# Altium project Push_counter.PrjPcb
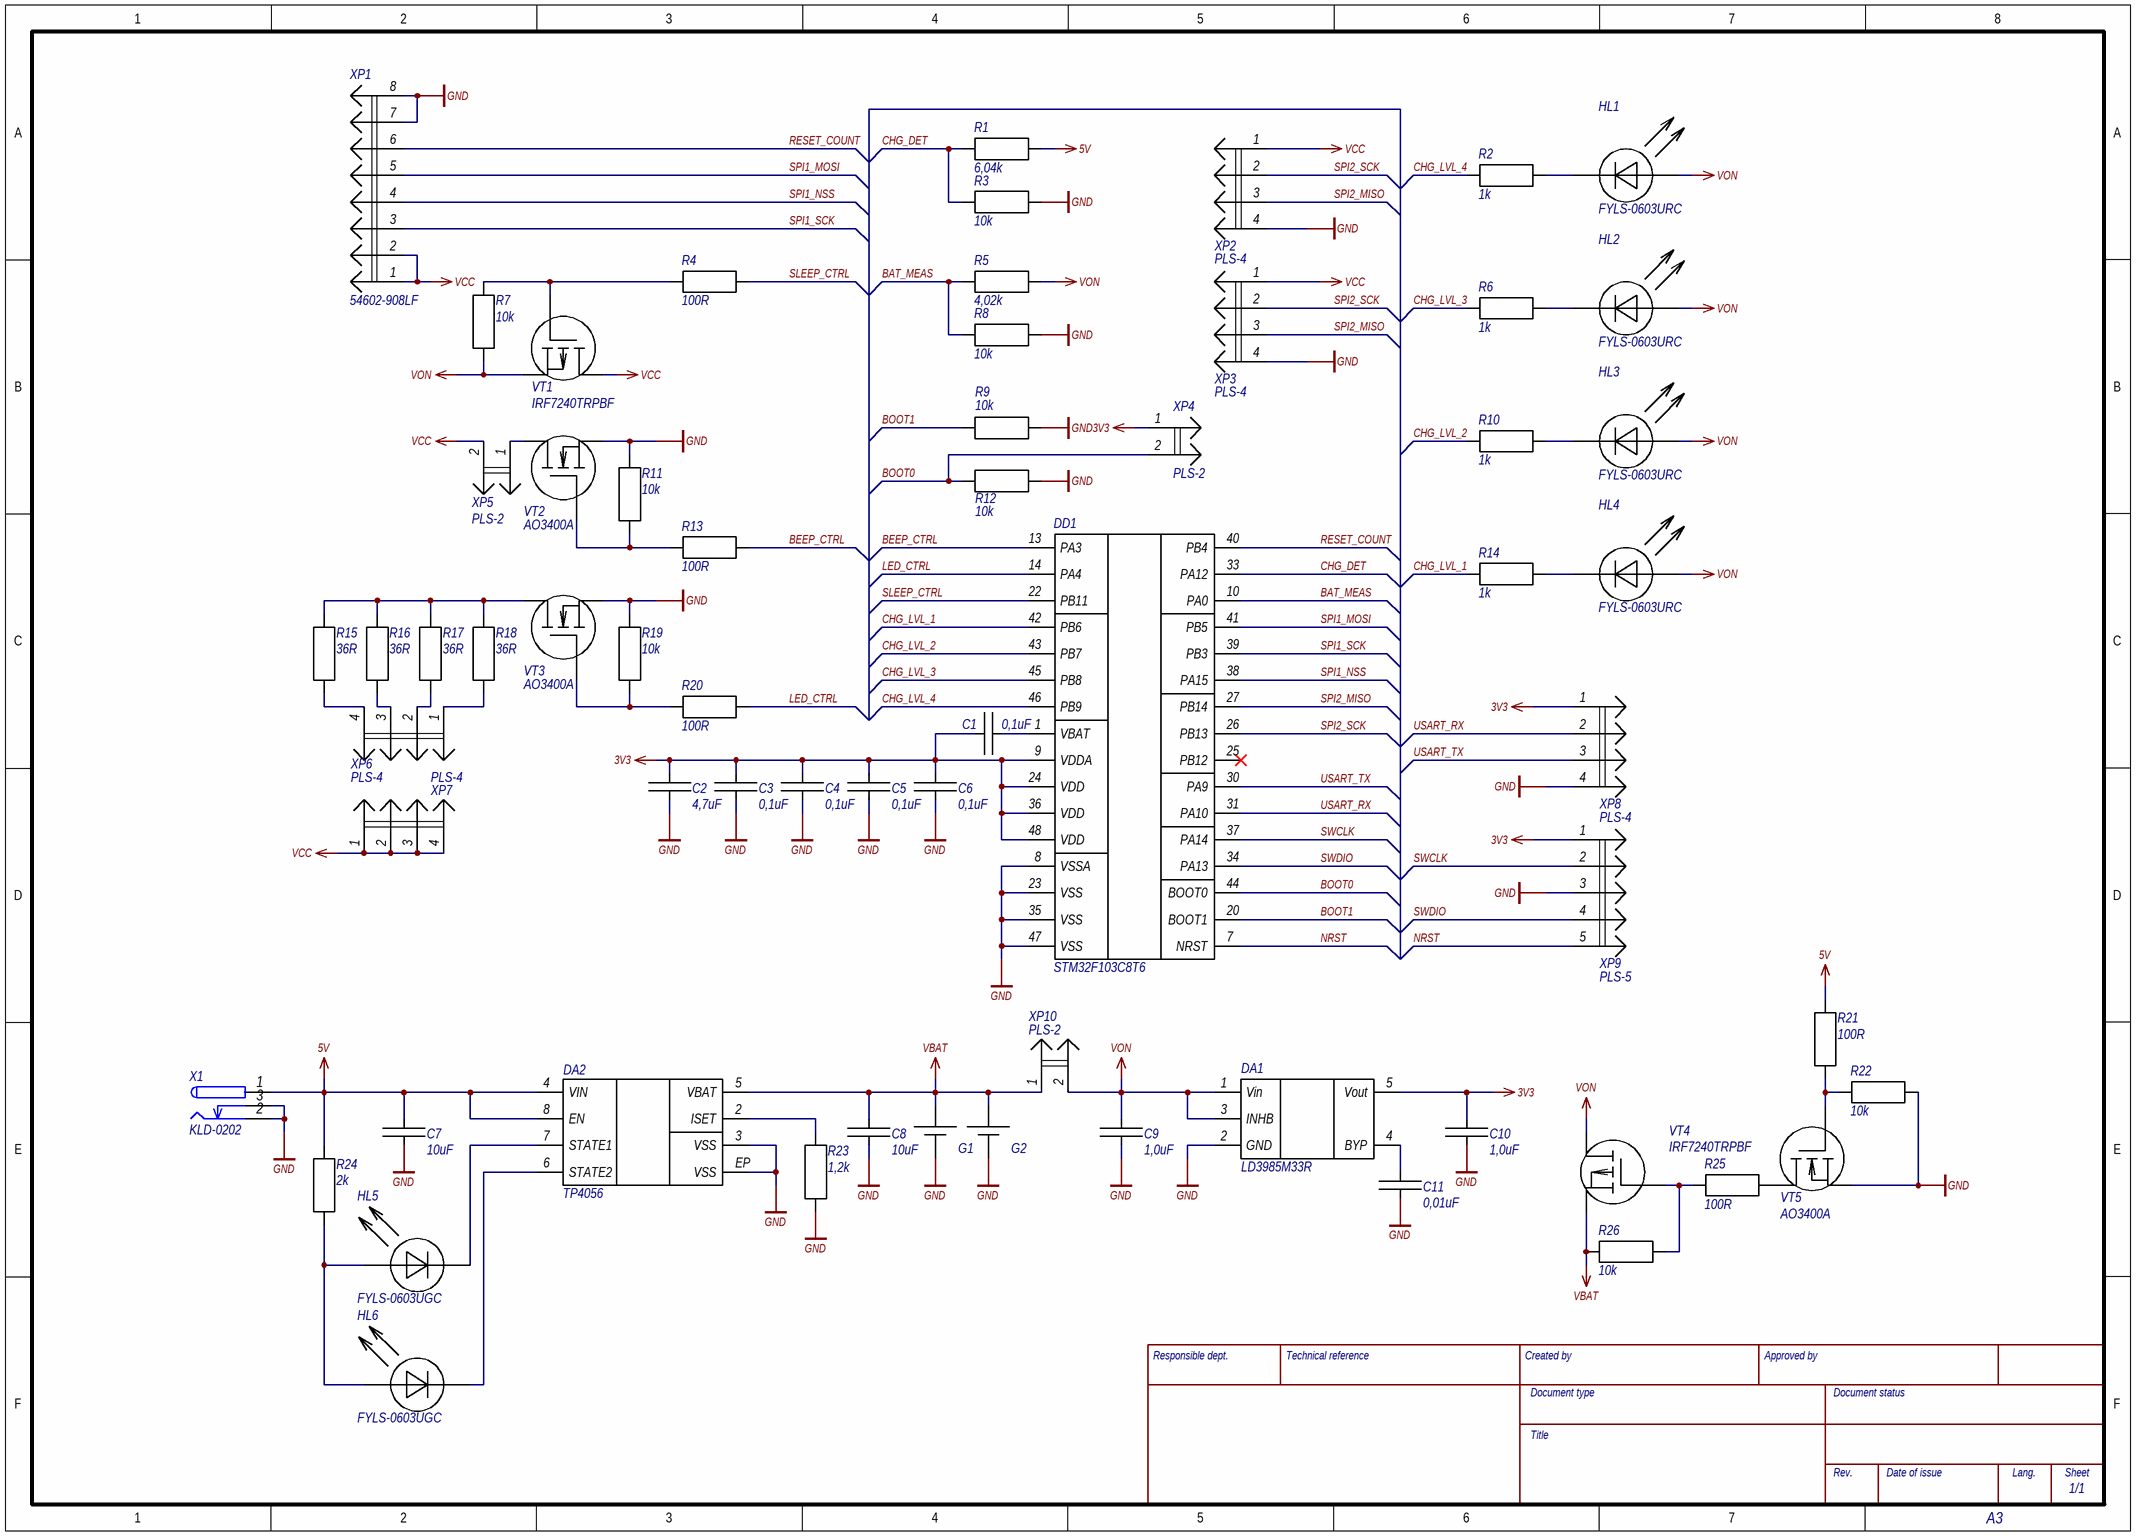
[diagram p0: Push_counter.SchDoc]
1 sheet, 64 parts. Net scope: global (net labels, ports and power ports of the same name join across sheets).
Board file: Push_counter.PcbDoc

## Sheet Push_counter.SchDoc
size 400 x 287 mm; SheetNumber: 1; SheetTotal: 1

### Parts
C1  0,1uF  [C0603C]
C2  4,7uF  [C0805C]
C3  0,1uF  [C0603C]
C4  0,1uF  [C0603C]
C5  0,1uF  [C0603C]
C6  0,1uF  [C0603C]
C7  10uF  [C1210C]
C8  10uF  [C1210C]
C9  1,0uF  [C0603C]
C10  1,0uF  [C0603C]
C11  0,01uF  [C0603C]
DA1  LD3985M33R  [SOT23-5]
DA2  TP4056  [SO-8-EP]
DD1  STM32F103C8T6  [LQFP48]
G1  KLS5-18650-L  [KLS5-18650-L]  (value not drawn)
G2  KLS5-18650-L  [KLS5-18650-L]  (value not drawn)
HL1  FYLS-0603URC  [LED0603]
HL2  FYLS-0603URC  [LED0603]
HL3  FYLS-0603URC  [LED0603]
HL4  FYLS-0603URC  [LED0603]
HL5  FYLS-0603UGC  [LED0603]
HL6  FYLS-0603UGC  [LED0603]
R1  6,04k  [C0603R]
R2  1k  [C0603R]
R3  10k  [C0603R]
R4  100R  [C0603R]
R5  4,02k  [C0603R]
R6  1k  [C0603R]
R7  10k  [C0603R]
R8  10k  [C0603R]
R9  10k  [C0603R]
R10  1k  [C0603R]
R11  10k  [C0603R]
R12  10k  [C0603R]
R13  100R  [C0603R]
R14  1k  [C0603R]
R15  36R  [C1206R]
R16  36R  [C1206R]
R17  36R  [C1206R]
R18  36R  [C1206R]
R19  10k  [C0603R]
R20  100R  [C0603R]
R21  100R  [C0603R]
R22  10k  [C0603R]
R23  1,2k  [C0603R]
R24  2k  [C0603R]
R25  100R  [C0603R]
R26  10k  [C0603R]
VT1  IRF7240TRPBF  [SO-8-SINGLE-FET]
VT2  AO3400A  [SOT23-3-FET]
VT3  AO3400A  [SOT23-3-FET]
VT4  IRF7240TRPBF  [SO-8-SINGLE-FET]
VT5  AO3400A  [SOT23-3-FET]
X1  KLD-0202  [KLD-0202]
XP1  54602-908LF  [54602-908LF]
XP2  PLS-4  [PLS-4]
XP3  PLS-4  [PLS-4]
XP4  PLS-2  [PLS-2]
XP5  PLS-2  [PLS-2]
XP6  PLS-4  [PLS-4]
XP7  PLS-4  [PLS-4]
XP8  PLS-4  [PLS-4]
XP9  PLS-5  [PLS-5]
XP10  PLS-2  [PLS-2]

### Nets
3V3: C1.1 C2.1 C3.1 C4.1 C5.1 C6.1 C10.1 DA1.5(Vout) DD1.9(VDDA) DD1.24(VDD) DD1.36(VDD) DD1.48(VDD) XP4.1 XP8.1 XP9.1
5V: C7.1 DA2.4(VIN) DA2.8(EN) R1.1 R21.1 R24.1 X1.1
GND: C2.2 C3.2 C4.2 C5.2 C6.2 C7.2 C8.2 C9.2 C10.2 C11.2 DA1.2(GND) DA2.3(VSS) DA2.EP(VSS) DD1.8(VSSA) DD1.23(VSS) DD1.35(VSS) DD1.47(VSS) G1.1(-) G2.1(-) R3.1 R8.1 R9.1 R11.1 R12.1 R19.1 R22.2 R23.2 VT2.S VT3.S VT5.S X1.2 X1.3 XP1.7 XP1.8 XP2.4 XP3.4 XP8.4 XP9.3
VBAT: C8.1 DA2.5(VBAT) G1.2(+) G2.2(+) R26.1 VT4.S XP10.1
VCC: VT1.D XP1.1 XP1.2 XP2.1 XP3.1 XP5.2 XP7.1 XP7.2 XP7.3 XP7.4
VON: C9.1 DA1.1(Vin) DA1.3(INHB) HL1.1(A) HL2.1(A) HL3.1(A) HL4.1(A) R5.1 R7.1 VT1.S VT4.D XP10.2
BAT_MEAS: DD1.10(PA0) R5.2 R8.2
BEEP_CTRL: DD1.13(PA3) R13.1
BOOT0: DD1.44(BOOT0) R12.2 XP4.2
BOOT1: DD1.20(BOOT1) R9.2
CHG_DET: DD1.33(PA12) R1.2 R3.2
CHG_LVL_1: DD1.42(PB6) R14.2
CHG_LVL_2: DD1.43(PB7) R10.2
CHG_LVL_3: DD1.45(PB8) R6.2
CHG_LVL_4: DD1.46(PB9) R2.2
LED_CTRL: DD1.14(PA4) R20.1
NRST: DD1.7(NRST) XP9.5
RESET_COUNT: DD1.40(PB4) XP1.6
SLEEP_CTRL: DD1.22(PB11) R4.1
SPI1_MOSI: DD1.41(PB5) XP1.5
SPI1_NSS: DD1.38(PA15) XP1.4
SPI1_SCK: DD1.39(PB3) XP1.3
SPI2_MISO: DD1.27(PB14) XP2.3 XP3.3
SPI2_SCK: DD1.26(PB13) XP2.2 XP3.2
SWCLK: DD1.37(PA14) XP9.2
SWDIO: DD1.34(PA13) XP9.4
USART_RX: DD1.31(PA10) XP8.2
USART_TX: DD1.30(PA9) XP8.3
NetC1_2: C1.2 DD1.1(VBAT)
NetC11_1: C11.1 DA1.4(BYP)
NetDA2_2: DA2.2(ISET) R23.1
NetDA2_6: DA2.6(STATE2) HL6.2(C)
NetDA2_7: DA2.7(STATE1) HL5.2(C)
NetHL1_2: HL1.2(C) R2.1
NetHL2_2: HL2.2(C) R6.1
NetHL3_2: HL3.2(C) R10.1
NetHL4_2: HL4.2(C) R14.1
NetHL5_1: HL5.1(A) HL6.1(A) R24.2
NetR4_2: R4.2 R7.2 VT1.G
NetR11_2: R11.2 R13.2 VT2.G
NetR15_1: R15.1 R16.1 R17.1 R18.1 VT3.D
NetR15_2: R15.2 XP6.4
NetR16_2: R16.2 XP6.3
NetR17_2: R17.2 XP6.2
NetR18_2: R18.2 XP6.1
NetR19_2: R19.2 R20.2 VT3.G
NetR21_2: R21.2 R22.1 VT5.G
NetR25_1: R25.1 R26.2 VT4.G
NetR25_2: R25.2 VT5.D
NetVT2_D: VT2.D XP5.1

Not connected (* = marked no-connect by the designer): DD1 25(PB12)*

### Notes on the sheet
- Responsible dept.
- Technical reference
- Created by
- Approved by
- Document type
- Document status
- Title
- Rev.
- Date of issue
- Lang.
- Sheet
- A3

### Library data of the parts
C1 C3-C6 = C0603C104K5RACAUTO: C0603C104K5RACAUTO, 0603 X7R  0,1 uF 50V; Manufacturer: KEMET; Value: 0,1; Tolerance: ±10%; Tmin: -55; Tmax: 125; Component Note: 0603 0,1uF ±10% 50V X7R; Part Number: C0603C104K5RACAUTO; Package: SMD 0603; Units: uF; Dielectric: X7R; Voltage: 50V; ComponentLink1Description: Datasheet
C2 = CL21B475KOFNFNE: CL21B475KOFNFNE, 0805 X7R 4,7 uF 16V; Manufacturer: Samsung; Value: 4,7; Tolerance: ±10%; Tmin: -55; Tmax: 125; Component Note: 0805 4,7uF ±10% 16V X7R; Part Number: CL21B475KOFNFNE; Package: SMD 0805; Units: uF; Dielectric: X7R; Voltage: 16V; ComponentLink1Description: Datasheet; ComponentLink1URL: https://media.digikey.com/pdf/Data%20Sheets/Samsung%20PDFs/CL_Series_MLCC_ds.pdf
C7 C8 = C3225X7R1H106M250AC: C3225X7R1H106M250AC, 1210 X7R 10 uF 50V; Manufacturer: TDK; Value: 10; Tolerance: ±20%; Tmin: -55; Tmax: 125; Component Note: 1210 10uF ±20% 50V X7R; Part Number: C3225X7R1H106M250AC; Package: SMD 1210; Units: uF; Dielectric: X7R; Voltage: 50V; ComponentLink1Description: Datasheet; ComponentLink1URL: https://ru.mouser.com/datasheet/2/400/lcc_commercial_general_en-837201.pdf
C9 C10 = CL10B105KA8NNNC: CL10B105KA8NNNC, 0603 X7R 1,0 uF 25V; Manufacturer: Samsung; Value: 1,0; Tolerance: ±10%; Tmin: -55; Tmax: 125; Component Note: 0603 1,0uF ±10% 25V X7R; Part Number: CL10B105KA8NNNC; Package: SMD 0603; Units: uF; Dielectric: X7R; Voltage: 25V; ComponentLink1Description: Datasheet; ComponentLink1URL: https://media.digikey.com/pdf/Data%20Sheets/Samsung%20PDFs/CL_Series_MLCC_ds.pdf
C11 = CL10B103KC8NNNC: CL10B103KC8NNNC, 0603 X7R 0,01 uF 100V; Manufacturer: Samsung; Value: 0,01; Tolerance: ±10%; Tmin: -55; Tmax: 125; Component Note: 0603 0,01uF ±10% 100V X7R; Part Number: CL10B103KC8NNNC; Package: SMD 0603; Units: uF; Dielectric: X7R; Voltage: 100V; ComponentLink1Description: Datasheet
DA1 = LD3985M33R: Linear Voltage Regulator; Manufacturer: Microchip Technology; TypeConvert: DC/DC; Vin: 5,5; VinMax: 6; Vout: 3,3; Iout: 0,5; Tmin: -40; Tmax: 125; BOM: DC/DC 5,5-6V, 3,3V,; Part Number: LD3985M33R; Package: SOT23-5; ComponentLink1Description: Datasheet; ComponentLink1URL: https://www.electronshik.ru/pdf/l/ld3985.pdf
DA2 = TP4056: Manufacturer: UMW; TypeConvert: SLLBC; Vin: 5; VinMax: 8; Iout: 1; Tmin: -40; Tmax: 125; BOM: SLLBC 5-8V, V,; Part Number: TP4056; Package: SO-8-EP; ComponentLink1Description: Datasheet; ComponentLink1URL: https://static.chipdip.ru/lib/848/DOC018848830.pdf
DD1 = STM32F103C8T6: STM32F103C8T6, 64 KB Flash, 20 KB RAM, LQFP48; Manufacturer: STMicroelectronics; Core: ARM Cortex-M3; CPU Speed: 1.25 DMIPS/MHz; FREQ: 72; RAM: 20 KB; FLASH: 64 KB; CAN: 1; Tmin: -40; Tmax: 125; Part Number: STM32F103C8T6; Package: LQFP48; EEPROM: -; ETH: -; ComponentLink1Description: Datasheet; Component Note: LQFP48
G1 G2 = KLS5-18650-L: KLS5-18650-L, , BAT; System: Connector; Part Number: KLS5-18650-L; Type: BAT; ComponentLink1Description: Datasheet
HL1-HL4 = FYLS-0603URC: SMD 0603 Red 30mA 80mcd; Manufacturer: Foryard; Alternative: LTST-C191KRKT Lite-On Inc; Voltage: 2.1V; Component Note: 0603, Red; Part Number: FYLS-0603URC; Package: SMD 0603; Color: Red; Current: 30mA; Luminous intensity: 80mcd; ComponentLink1Description: Datasheet; ComponentLink1URL: https://sds.compel.ru/item-pdf/af7b1cc2bbe1d373f48bd8c95fbe7607/pn/foryard~fyls-0603urc.pdf
HL5 HL6 = FYLS-0603UGC: SMD 0603 Green 30mA 65mcd; Manufacturer: Foryard; Alternative: LTST-C191KGKT Lite-On Inc; Voltage: 2V; Component Note: 0603, Green; Part Number: FYLS-0603UGC; Package: SMD 0603; Color: Green; Current: 30mA; Luminous intensity: 65mcd; ComponentLink1Description: Datasheet; ComponentLink1URL: https://sds.compel.ru/item-pdf/bfcdb1ef531cd95dc93bcbdb85ab35c3/pn/foryard~fyls-0603ugc.pdf
R1 = RC0603FR-076K04L: RC0603FR-076K04L, 1% 6,04k; Manufacturer: Yageo; ppm: 100; Power: 0,1; Voltage: 75; Component Note: 0603 6,04k 1%; Part Number: RC0603FR-076K04L; Package: SMD 0603; Value: 6,04k; Tolerance: 1%
R2 R6 R10 R14 = RC0603JR-071KL: RC0603JR-071KL, 5% 1k; Manufacturer: Yageo; ppm: 100; Power: 0,1; Voltage: 75; Component Note: 0603 1k 5%; Part Number: RC0603JR-071KL; Package: SMD 0603; Value: 1k; Tolerance: 5%
R3 R8 = RC0603FR-0710KL: RC0603FR-0710KL, 1% 10k; Manufacturer: Yageo; ppm: 100; Power: 0,1; Voltage: 75; Component Note: 0603 10k 1%; Part Number: RC0603FR-0710KL; Package: SMD 0603; Value: 10k; Tolerance: 1%
R4 R13 R20 R21 R25 = RC0603FR-07100RL: RC0603FR-07100RL, 1% 100R; Manufacturer: Yageo; ppm: 100; Power: 0,1; Voltage: 75; Component Note: 0603 100R 1%; Part Number: RC0603FR-07100RL; Package: SMD 0603; Value: 100R; Tolerance: 1%
R5 = RC0603FR-074K02L: RC0603FR-074K02L, 1% 4,02k; Manufacturer: Yageo; ppm: 100; Power: 0,1; Voltage: 75; Component Note: 0603 4,02k 1%; Part Number: RC0603FR-074K02L; Package: SMD 0603; Value: 4,02k; Tolerance: 1%
R7 R9 R11 R12 R19 R22 R26 = RC0603JR-0710KL: RC0603JR-0710KL, 5% 10k; Manufacturer: Yageo; ppm: 100; Power: 0,1; Voltage: 75; Component Note: 0603 10k 5%; Part Number: RC0603JR-0710KL; Package: SMD 0603; Value: 10k; Tolerance: 5%
R15-R18 = RC1206JR-0736RL: RC1206JR-0736RL, 5% 36R; Manufacturer: Yageo; ppm: 100; Power: 0,125; Voltage: 150; Component Note: 1206 36R 5%; Part Number: RC1206JR-0736RL; Package: SMD 1206; Value: 36R; Tolerance: 5%
R23 = RC0603JR-071K2L: RC0603JR-071K2L, 5% 1,2k; Manufacturer: Yageo; ppm: 100; Power: 0,1; Voltage: 75; Component Note: 0603 1,2k 5%; Part Number: RC0603JR-071K2L; Package: SMD 0603; Value: 1,2k; Tolerance: 5%
R24 = RC0603JR-072KL: RC0603JR-072KL, 5% 2k; Manufacturer: Yageo; ppm: 100; Power: 0,1; Voltage: 75; Component Note: 0603 2k 5%; Part Number: RC0603JR-072KL; Package: SMD 0603; Value: 2k; Tolerance: 5%
VT1 VT4 = IRF7240TRPBF: IRF7240TRPBF, SO-8 A V; Manufacturer: Infineon; Type: P; Component Note: SO-8, P, V, A; Part Number: IRF7240TRPBF; Package: SO-8; ComponentLink1Description: Datasheet; ComponentLink1URL: https://static.chipdip.ru/lib/404/DOC016404580.pdf
VT2 VT3 VT5 = AO3400A: AO3400A, SOT23-3 5A 30V; Manufacturer: UMW; Type: N; I Drain: 5; U Gate th: 1,4; U Gate max: 12; U Drain-Source: 30; Input Cap: 1050; RDS: 0,033; P: 1W; Component Note: SOT23-3, N, 30V, 5A; Part Number: AO3400A; Package: SOT23-3; Qg: 12; ComponentLink1Description: Datasheet; ComponentLink1URL: https://static.chipdip.ru/lib/975/DOC014975392.pdf
X1 = KLD-0202: KLD-0202, Kycon,; System: Connector; Part Number: KLD-0202; Manufacturer: Kycon; ComponentLink1Description: Datasheet
XP1 = 54602-908LF: 54602-908LF, , ETH; System: Connector; Part Number: 54602-908LF; Type: ETH; ComponentLink1Description: Datasheet
XP2 XP3 XP6-XP8 = PLS-4: PLS-4, , PLS 4 Pins; System: Connector; Part Number: PLS-4; Type: PLS; Pins: 4; ComponentLink1Description: Datasheet
XP4 XP5 XP10 = PLS-2: PLS-2, , PLS 2 Pins; System: Connector; Part Number: PLS-2; Type: PLS; Pins: 2; ComponentLink1Description: Datasheet
XP9 = PLS-5: PLS-5, , PLS 5 Pins; System: Connector; Part Number: PLS-5; Type: PLS; Pins: 5; ComponentLink1Description: Datasheet